# EAGLE design breakout.Rev0 (EAGLE 9.6.0)
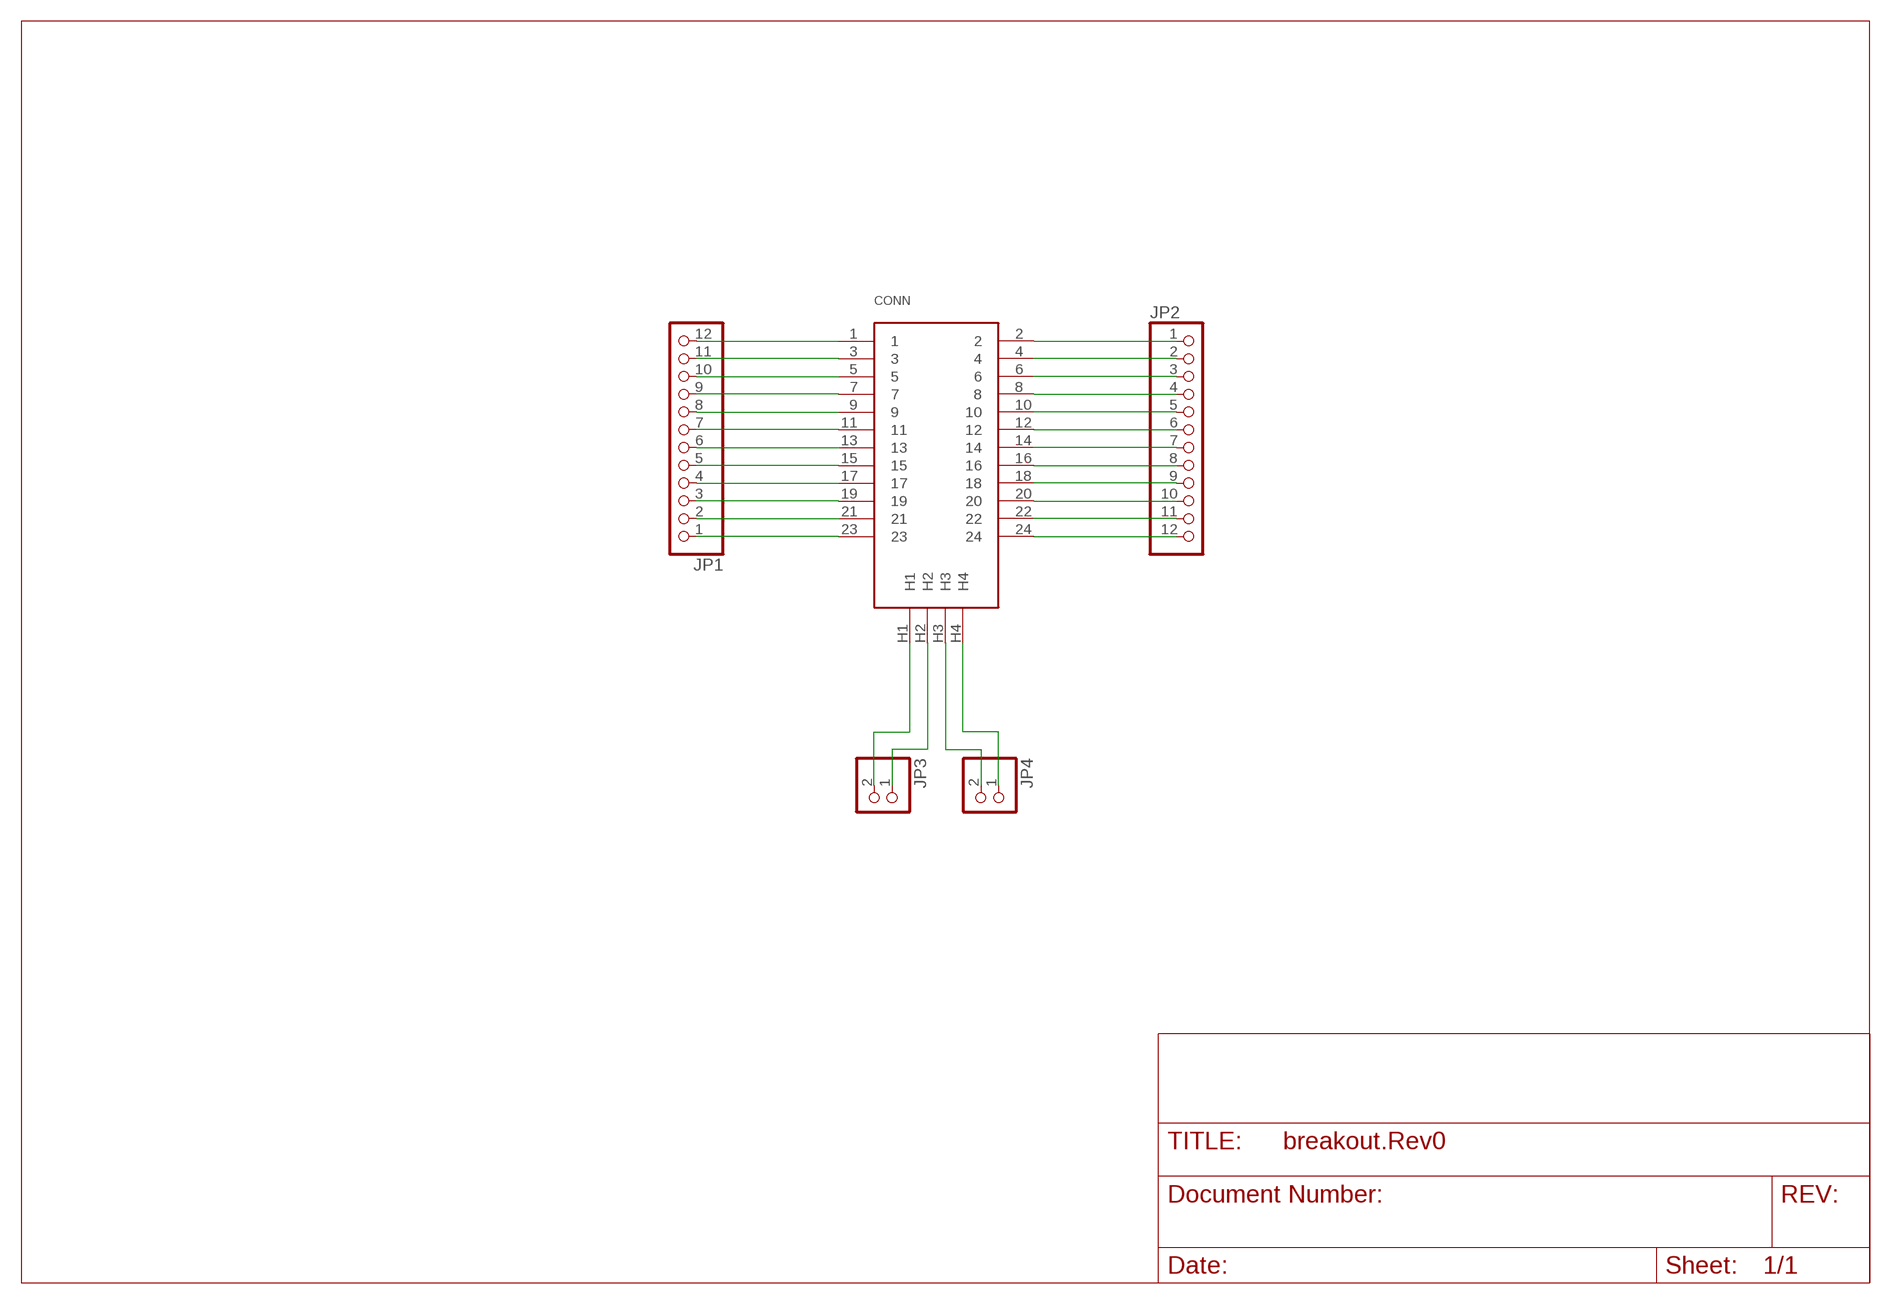
[diagram p0: schematic, sheet 1]

## Parts
CONN  BM28B0.6-24DS/2-0.35V(51)  [BM28B0.6-24DS/2-0.35V(51)]
JP1  PINHD-1X12  [1X12]
JP2  PINHD-1X12  [1X12]
JP3  PINHD-1X2  [1X02]
JP4  PINHD-1X2  [1X02]

## Nets
N$1: CONN.2 JP2.1
N$2: CONN.4 JP2.2
N$3: CONN.6 JP2.3
N$4: CONN.8 JP2.4
N$5: CONN.10 JP2.5
N$6: CONN.12 JP2.6
N$7: CONN.14 JP2.7
N$8: CONN.16 JP2.8
N$9: CONN.18 JP2.9
N$10: CONN.20 JP2.10
N$11: CONN.22 JP2.11
N$12: CONN.24 JP2.12
N$13: CONN.H3 JP4.2
N$14: CONN.H4 JP4.1
N$15: CONN.H2 JP3.1
N$16: CONN.H1 JP3.2
N$17: CONN.23 JP1.1
N$18: CONN.21 JP1.2
N$19: CONN.19 JP1.3
N$20: CONN.17 JP1.4
N$21: CONN.15 JP1.5
N$22: CONN.13 JP1.6
N$23: CONN.11 JP1.7
N$24: CONN.9 JP1.8
N$25: CONN.7 JP1.9
N$26: CONN.5 JP1.10
N$27: CONN.3 JP1.11
N$28: CONN.1 JP1.12

## Library data of the parts
CONN = myLib:BM28B0.6-24DS/2-0.35V(51)
JP1 JP2 = pinhead:PINHD-1X12: PIN HEADER
JP3 JP4 = pinhead:PINHD-1X2: PIN HEADER

## Board
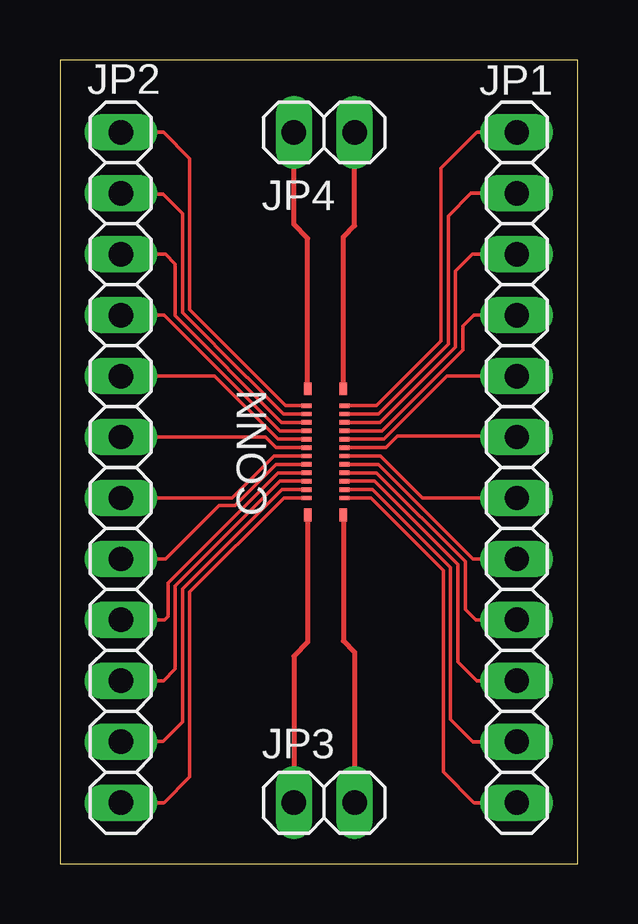
[diagram p1: board, top side]

Size 21.6 x 33.5 mm. Coordinates in mm from the lower left corner, seen from the top.
Outline: 0,0 21.6,0 21.6,33.5 0,33.5 0,0
Copper layers (1*16): Top 0.035mm / dielectric 1.5mm / Bottom 0.035mm
Design rules "default": minimum track width 6mil, minimum drill 0.35mm, track to track 6mil, track to pad 6mil, pad to pad 6mil, via to via 6mil, smd to smd 6mil, copper to edge 40mil, drill to drill 6mil, minimum pad ring 10mil, minimum via ring 8mil, stop-mask expansion 4mil, vias tented up to drill 0mil, thermal gap 10mil

### Footprints (pad centres in the part's own frame; a part is rotated, then mirrored left to right if it is on the bottom)
BM28B0.6-24DS/2-0.35V(51) = smd 0.18 x 0.41: 1 0,0; 2 0,1.59; 3 0.35,0; 4 0.35,1.59; 5 0.7,0; 6 0.7,1.59; 7 1.05,0; 8 1.05,1.59; 9 1.4,0; 10 1.4,1.59; 11 1.75,0; 12 1.75,1.59; 13 2.1,0; 14 2.1,1.59; 15 2.45,0; 16 2.45,1.59; 17 2.8,0; 18 2.8,1.59; 19 3.15,0; 20 3.15,1.59; 21 3.5,0; 22 3.5,1.59; 23 3.85,0; 24 3.85,1.59 | smd 0.53 x 0.31: H1 -0.705,0.05; H2 -0.705,1.54; H3 4.555,0.05; H4 4.555,1.54
1X12 = drill 1.016 long: 1 -13.97,0; 2 -11.43,0; 3 -8.89,0; 4 -6.35,0; 5 -3.81,0; 6 -1.27,0; 7 1.27,0; 8 3.81,0; 9 6.35,0; 10 8.89,0; 11 11.43,0; 12 13.97,0
1X02 = drill 1.016 long: 1 -1.27,0; 2 1.27,0

### Placement (x,y rotation side)
CONN  11.87,15.24 90 top
JP1  19.05,16.51 270 top
JP2  2.54,16.51 90 top
JP3  11.02,2.54 0 top
JP4  11.02,30.48 0 top

### Tracks (layer width: path | path; a pad name or v marks a point on that pad's centre or on a via)
N$1
  Top 0.152: CONN.2 9.34,15.24 5.41,11.31 5.41,3.61 4.34,2.54 JP2.1
N$2
  Top 0.152: CONN.4 9.26,15.59 5.11,11.44 5.11,5.91 4.3,5.1 2.56,5.1 JP2.2
N$3
  Top 0.152: CONN.6 9.18,15.94 4.8,11.57 4.8,8.11 4.32,7.62 JP2.3
N$4
  Top 0.152: CONN.8 9.1,16.29 4.5,11.69 4.5,10.3 4.36,10.16 JP2.4
N$5
  Top 0.152: CONN.10 9.02,16.64 7.31,14.94 6.63,14.94 4.4,12.7 JP2.5
N$6
  Top 0.152: CONN.12 8.94,16.99 7.18,15.24 JP2.6
N$7
  Top 0.152: CONN.14 9.01,17.34 8.56,17.78 JP2.7
N$8
  Top 0.152: CONN.16 9.09,17.69 6.46,20.32 JP2.8
N$9
  Top 0.152: CONN.18 9.17,18.04 4.35,22.86 JP2.9
N$10
  Top 0.152: CONN.20 9.25,18.39 4.8,22.84 4.8,25 4.4,25.4 JP2.10
N$11
  Top 0.152: CONN.22 9.33,18.74 7.83,20.23 7.78,20.28 5.11,22.96 5.11,27.09 4.3,27.9 2.58,27.9 JP2.11
N$12
  Top 0.152: CONN.24 9.41,19.09 5.41,23.09 5.41,26.5 5.41,26.6 5.41,29.39 4.32,30.48 JP2.12
N$13
  Top 0.2: CONN.H3 11.82,26.12 12.29,26.59 JP4.2
N$14
  Top 0.2: CONN.H4 10.33,26.07 9.75,26.65 JP4.1
N$15
  Top 0.2: CONN.H2 10.33,9.23 9.75,8.65 JP3.1
N$16
  Top 0.2: CONN.H1 11.82,9.28 12.29,8.81 JP3.2
N$17
  Top 0.152: CONN.23 13.19,19.09 15.89,21.79 15.89,28.99 17.38,30.48 JP1.1
N$18
  Top 0.152: CONN.21 13.27,18.74 16.19,21.66 16.19,24 16.19,24.1 16.19,26.99 17.14,27.94 JP1.2
N$19
  Top 0.152: CONN.19 13.35,18.39 16.5,21.53 16.5,24.7 17.2,25.4 JP1.3
N$20
  Top 0.152: CONN.17 13.43,18.04 16.8,21.41 16.8,22.4 17.26,22.86 JP1.4
N$21
  Top 0.152: CONN.15 13.51,17.69 16.14,20.32 JP1.5
N$22
  Top 0.152: CONN.13 13.6,17.34 14.08,17.82 19.01,17.82 JP1.6
N$23
  Top 0.152: CONN.11 13.37,16.99 15.12,15.24 JP1.7
N$24
  Top 0.152: CONN.9 13.28,16.64 17.22,12.7 JP1.8
N$25
  Top 0.152: CONN.7 13.2,16.29 16.9,12.59 16.9,10.6 17.34,10.16 JP1.9
N$26
  Top 0.152: CONN.5 13.12,15.94 16.59,12.47 16.59,8.4 17.38,7.62 JP1.10
N$27
  Top 0.152: CONN.3 13.04,15.59 16.29,12.34 16.29,6.01 17.22,5.08 JP1.11
N$28
  Top 0.152: CONN.1 12.96,15.24 15.99,12.21 15.99,3.81 17.26,2.54 JP1.12

### Text on the board
Reference: BM28B0.6-24DS/2-0.35V(51) / BREAKOUT | EZ